# EAGLE design watchplb_gps_v1.0_AB (EAGLE 7.6.0)
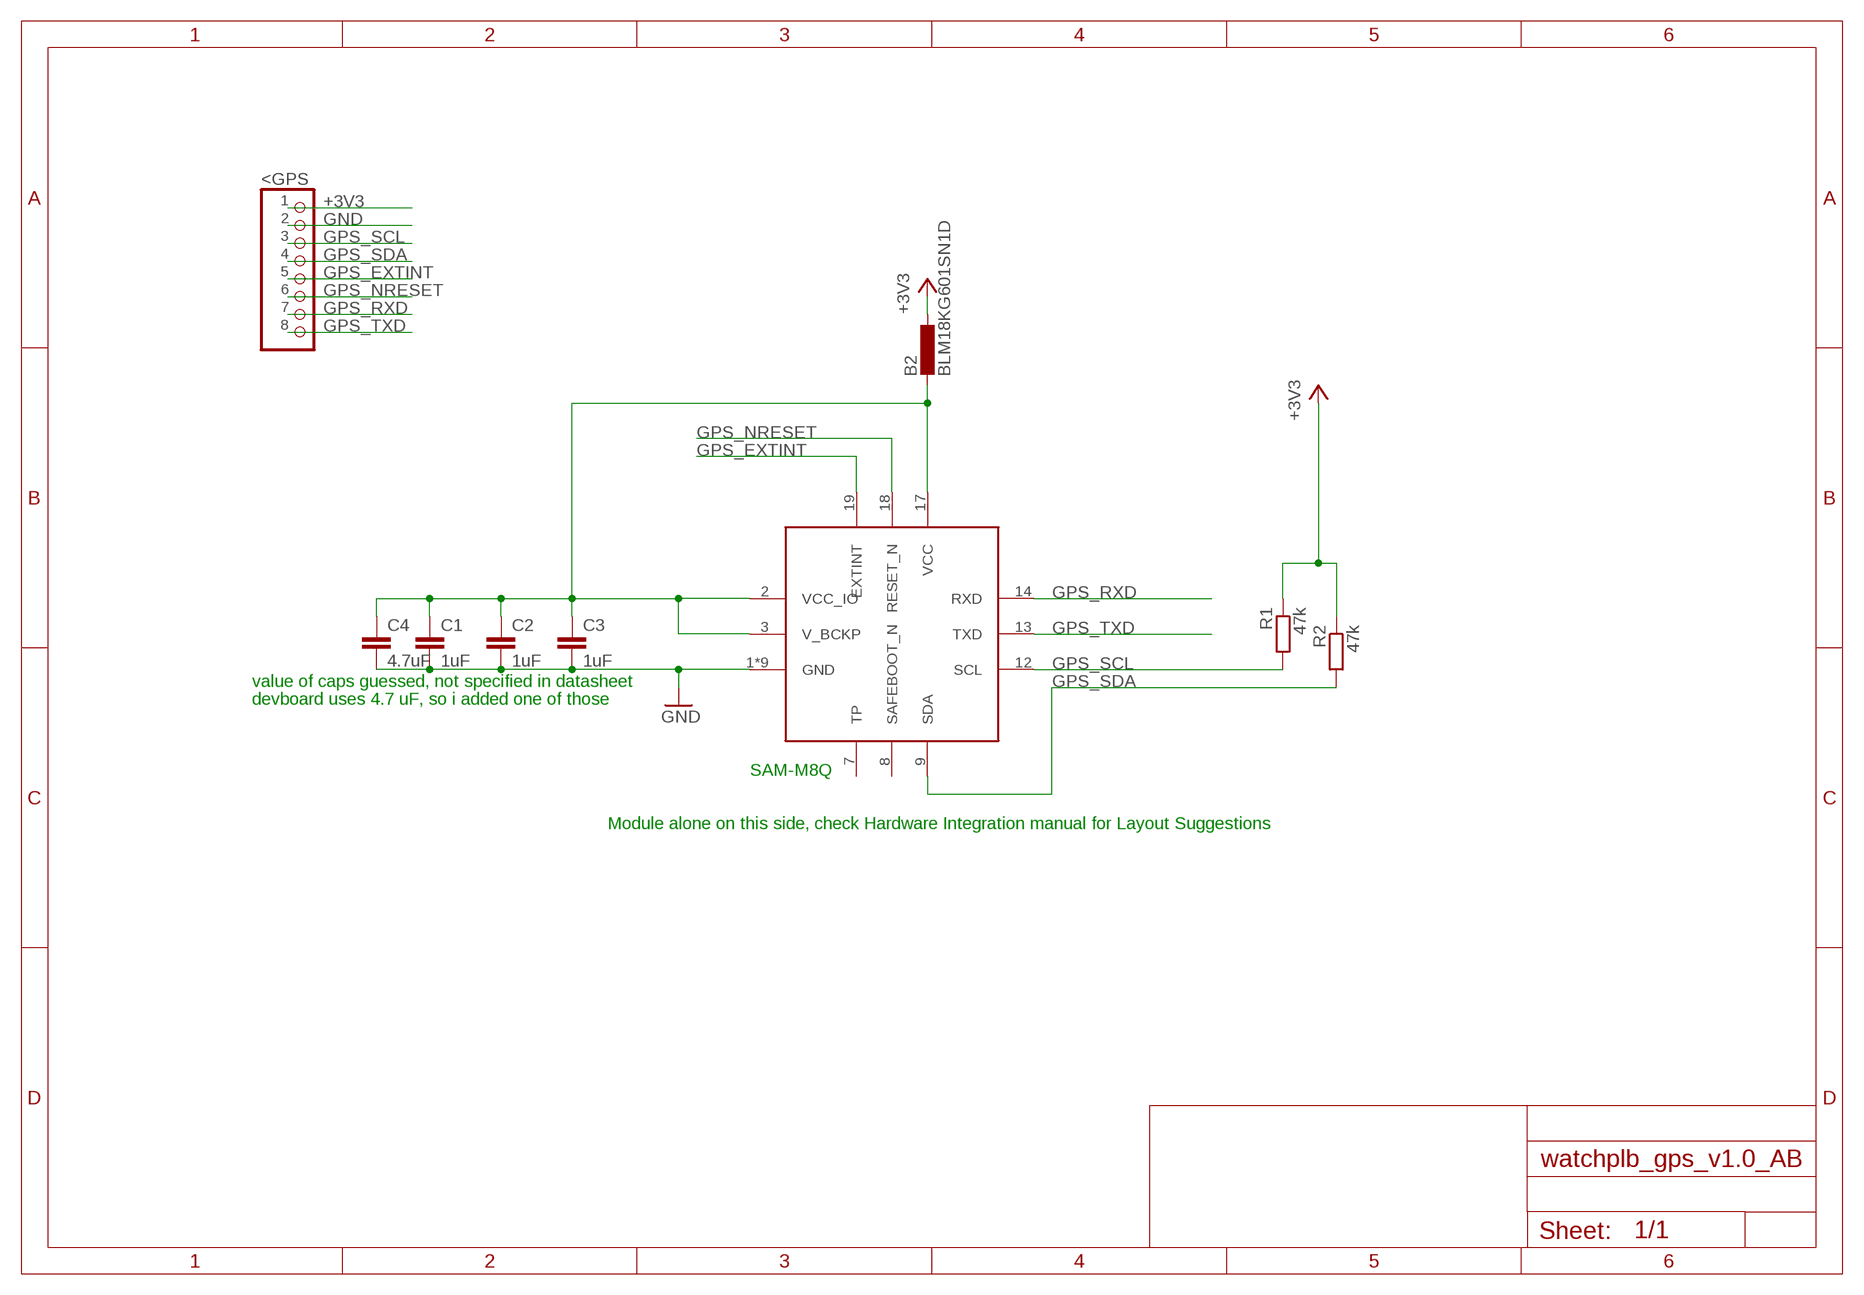
[diagram p0: schematic, sheet 1]

## Parts
<GPS  PINHD-1X8  [1X08]
B2  BLM18KG601SN1D  B-EU_B0603  [L0603]
C1  1uF  C-EUC0805  [C0805]
C2  1uF  C-EUC0805  [C0805]
C3  1uF  C-EUC0805  [C0805]
C4  4.7uF  C-EUC0805  [C0805]
IC1  SAM-M8Q  [SAM-M8Q]
R1  47k  R-EU_M0805  [M0805]
R2  47k  R-EU_M0805  [M0805]

## Nets
+3V3: <GPS.1 B2.1 R1.1 R2.1
GND: <GPS.2 C1.2 C2.2 C3.2 C4.2 IC1.1(GND) IC1.4(GND) IC1.5(GND) IC1.6(GND) IC1.10(GND) IC1.11(GND) IC1.15(GND) IC1.16(GND) IC1.20(GND)
GPS_EXTINT: <GPS.5 IC1.19(EXTINT)
GPS_NRESET: <GPS.6 IC1.18(RESET_N)
GPS_RXD: <GPS.7 IC1.14(RXD)
GPS_SCL: <GPS.3 IC1.12(SCL) R1.2
GPS_SDA: <GPS.4 IC1.9(SDA) R2.2
GPS_TXD: <GPS.8 IC1.13(TXD)
N$79: B2.2 C1.1 C2.1 C3.1 C4.1 IC1.2(VCC_IO) IC1.3(V_BCKP) IC1.17(VCC)
Unconnected: IC1.7(TP) IC1.8(SAFEBOOT_N)

## Notes on the sheet
- value of caps guessed, not specified in datasheet
- devboard uses 4.7 uF, so i added one of those
- SAM-M8Q
- Module alone on this side, check Hardware Integration manual for Layout Suggestions

## Library data of the parts
<GPS = pinhead:PINHD-1X8: PIN HEADER
B2 = PCB4_Demoboard:B-EU_: EMI Filter
C1-C4 = resistor:C-EU: CAPACITOR, European symbol
IC1 = ubloxLib:SAM-M8Q: u-blox SAM GNSS antenna module
R1 R2 = resistor:R-EU_: RESISTOR, European symbol

## Board
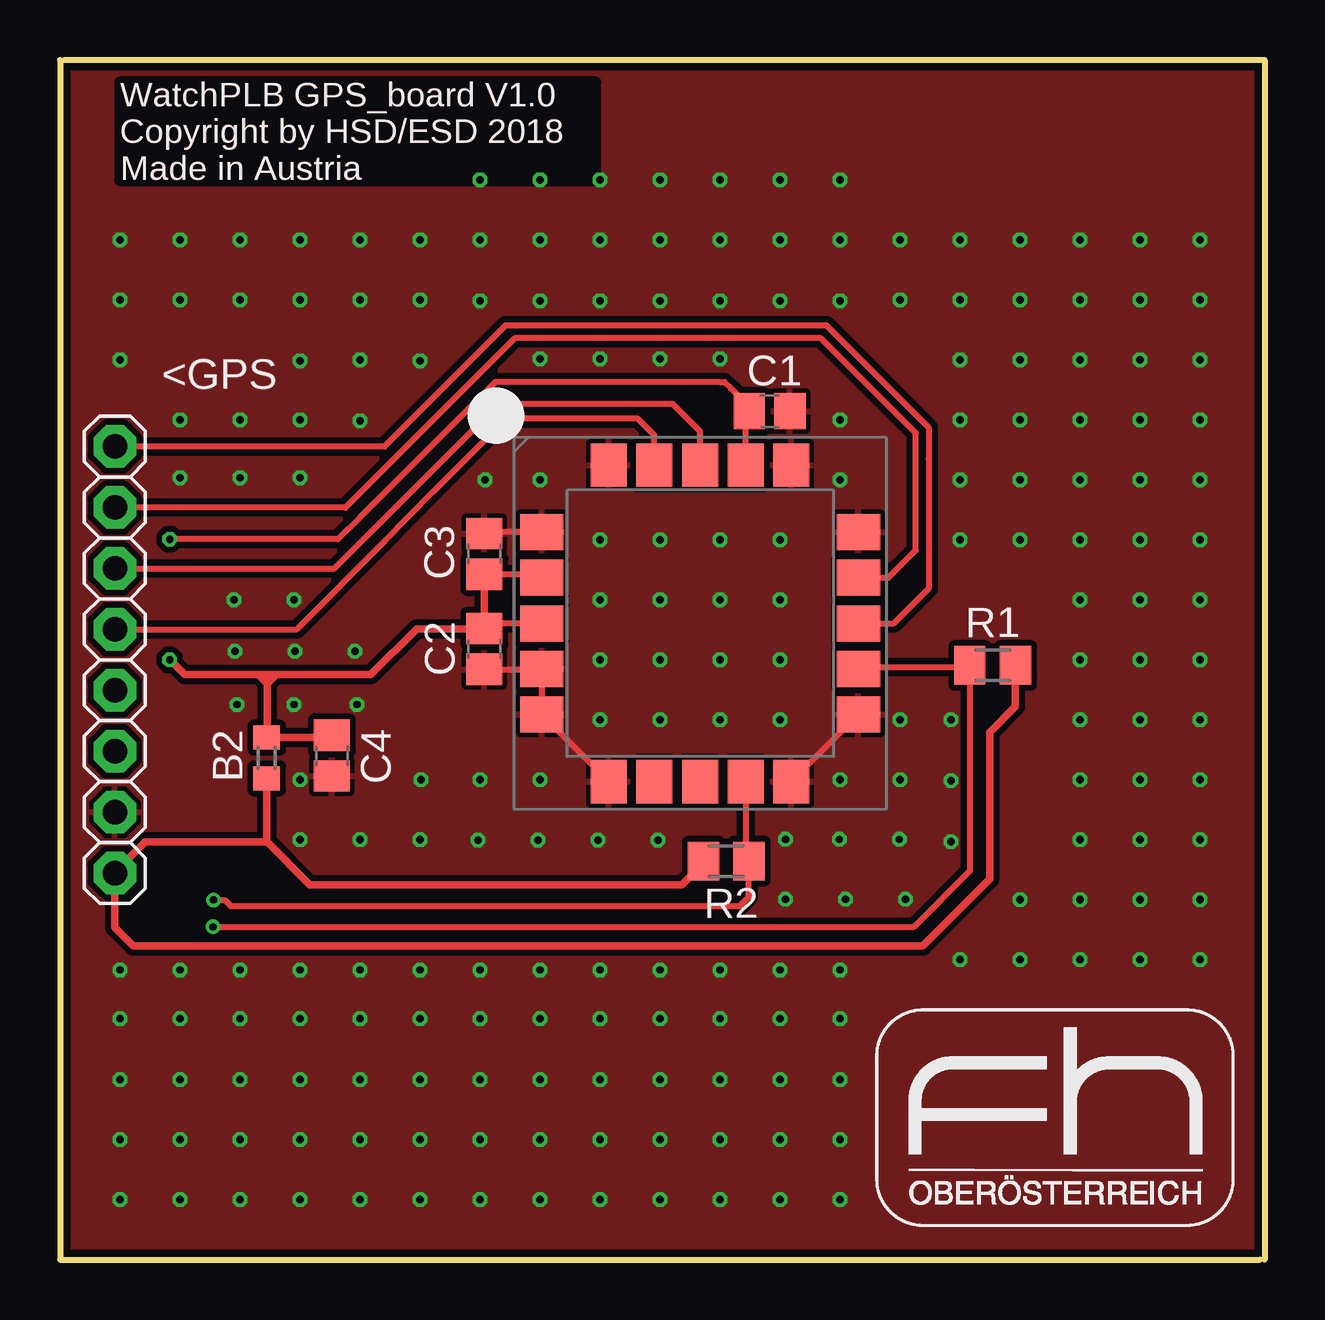
[diagram p1: board, top side]
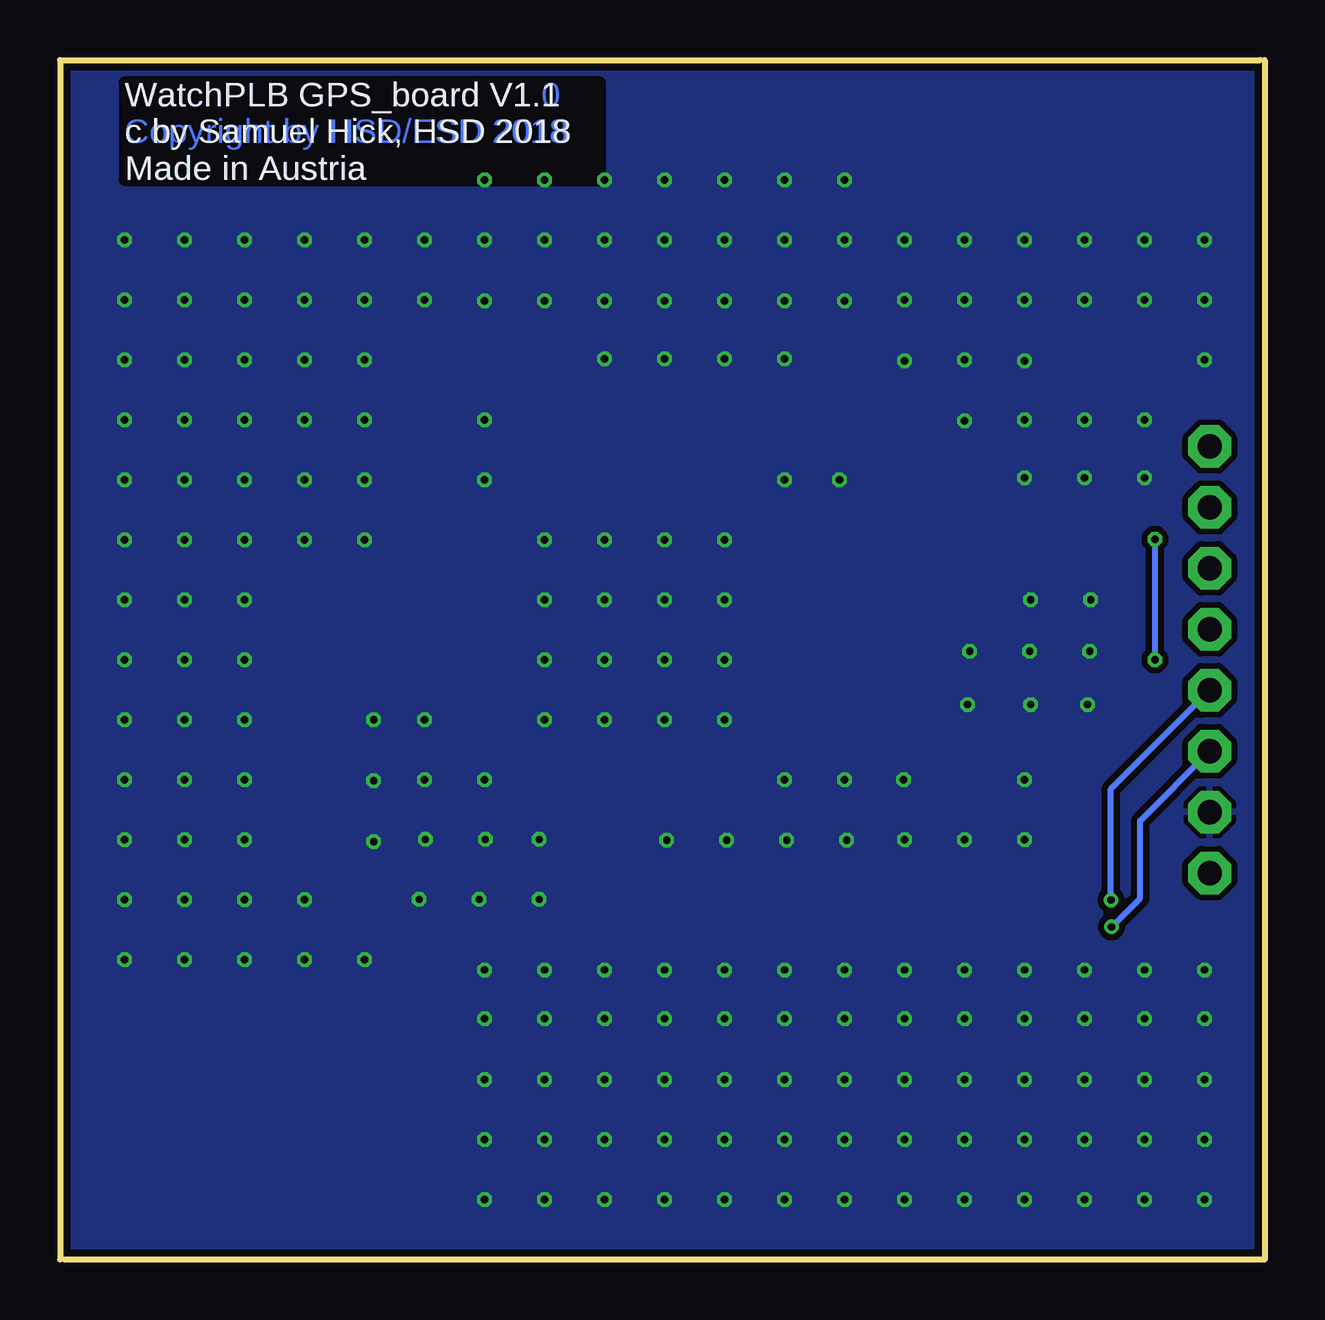
[diagram p2: board, bottom side, seen from below]

Size 50.19 x 50 mm. Coordinates in mm from the lower left corner, seen from the top.
Outline: 50.19,0 50.19,50 0.19,50
Outline: 0,50 0,0 50,0
Copper layers (1*16): Top 0.035mm / dielectric 1.5mm / Bottom 0.035mm
Design rules "PCB-POOL Standard": minimum track width 0.15mm, minimum drill 0.3mm, track to track 0.15mm, track to pad 0.15mm, pad to pad 0.15mm, via to via 0.15mm, smd to smd 0.15mm, copper to edge 0.3mm, drill to drill 0.2mm, minimum pad ring 0.2mm, minimum via ring 0.15mm, stop-mask expansion 0.075mm, vias tented up to drill 0mil, thermal gap 0.2mm

### Footprints (pad centres in the part's own frame; a part is rotated, then mirrored left to right if it is on the bottom)
1X08 = drill 1.016 pad 1.778 octagon: 1 -8.89,0; 2 -6.35,0; 3 -3.81,0; 4 -1.27,0; 5 1.27,0; 6 3.81,0; 7 6.35,0; 8 8.89,0
L0603 = smd 1 x 1.1: 1 -0.85,0; 2 0.85,0
C0805 = smd 1.3 x 1.5: 1 -0.85,0; 2 0.85,0
SAM-M8Q = smd 1.8 x 1.5: 1 -6.6,3.8; 2 -6.6,1.9; 3 -6.6,0; 4 -6.6,-1.9; 5 -6.6,-3.8; 11 6.6,-3.8; 12 6.6,-1.9; 13 6.6,0; 14 6.6,1.9; 15 6.6,3.8 | smd 1.5 x 1.8: 6 -3.8,-6.6; 7 -1.9,-6.6; 8 0,-6.6; 9 1.9,-6.6; 10 3.8,-6.6; 16 3.8,6.6; 17 1.9,6.6; 18 0,6.6; 19 -1.9,6.6; 20 -3.8,6.6
M0805 = smd 1.3 x 1.6: 1 -0.95,0; 2 0.95,0

### Placement (x,y rotation side)
<GPS  2.29,25 90 top
B2  8.61,20.9 90 top
C1  29.57,35.36 0 top
C2  17.68,25.45 270 top
C3  17.68,29.41 90 top
C4  11.33,21.01 270 top
IC1  26.67,26.52 0 top
R1  38.86,24.77 180 top
R2  27.76,16.61 0 top
U$1  [FH_LOGO_050]  33.79,1.21 0 top

### Tracks (layer width: path | path; a pad name or v marks a point on that pad's centre or on a via)
+3V3
  Top 0.305: 8.64,20.03 B2.1 8.61,19.15 8.61,17.4 | R1.1 39.81,23.05 38.73,21.97 38.73,15.88 35.94,13.08 3.05,13.08 2.29,13.84 <GPS.1 2.29,16.13 3.56,17.4 6.86,17.4 8.61,17.4 | R2.1 26.42,16.21 26.42,16.13 26.16,15.88 25.91,15.62 10.92,15.62 10.41,15.62 8.64,17.4 8.61,17.4
GND  (via drill 0.3)
  Top 0.254: C2.2 19.9,24.6 IC1.4 IC1.5 IC1.6 | IC1.10 IC1.11 | IC1.1 17.58,30.32 C3.2
  other vias: 5,5 2.5,5 2.5,2.5 5,2.5 2.5,7.5 5,7.5 7.5,7.5 7.5,5 7.5,2.5 10,2.5 10,5 10,7.5 12.5,7.5 12.5,5 12.5,2.5 27.5,5 25,5 25,2.5 27.5,2.5 25,7.5 27.5,7.5 30,7.5 30,5 30,2.5 32.5,2.5 32.5,5 32.5,7.5 37.5,12.5 40,12.5 42.5,12.5 45,12.5 47.5,12.5 40,15 15,5 15,2.5 15,7.5 17.5,7.5 17.5,5 17.5,2.5 20,2.5 20,5 20,7.5 22.5,7.5 22.5,5 22.5,2.5 42.5,15 42.5,17.5 42.5,20 45,20 45,17.5 45,15 47.5,15 47.5,17.5 47.5,20 42.5,25 42.5,22.5 45,22.5 45,25 47.5,25 47.5,22.5 42.5,27.5 42.5,30 42.5,32.5 45,32.5 45,30 45,27.5 47.5,27.5 47.5,30 47.5,32.5 40,30 37.5,30 37.5,32.5 40,32.5 40,35 37.5,35 37.5,37.5 40,37.5 42.5,37.5 42.5,35 45,35 45,37.5 47.5,37.5 47.5,35 42.5,42.5 42.5,40 45,40 45,42.5 47.5,42.5 47.5,40 40,40 37.5,40 37.5,42.5 40,42.5 35,42.5 35,40 32.5,42.5 32.5,45 30,45 30,42.5 27.5,42.5 27.5,45 25,45 25,42.5 22.5,42.5 22.5,45 20,45 20,42.5 17.5,42.5 17.5,45 15,42.5 15,40 12.5,40 12.5,37.5 10,35 7.5,35 5,35 2.5,37.5 5,40 2.5,40 2.5,42.5 5,42.5 7.5,42.5 10,42.5 12.5,42.5 10,40 7.5,40 7.37,23.14 9.75,23.14 12.37,23.14 15.04,20 12.5,17.5 10,17.5 10,20 15,17.5 17.5,20 20,20 32.5,20 35,20 35,22.5 37.12,22.5 32.5,32.5 32.5,35 30,30 27.5,30 25,30 22.5,30 22.5,27.5 25,27.5 27.5,27.5 30,27.5 30,25 27.5,25 25,25 22.5,25 22.5,22.5 25,22.5 27.5,22.5 30,22.5 20,32.5 7.25,27.5 9.75,27.5 2.5,10.04 5,10.04 7.5,10.04 10,10.04 12.5,10.04 25,10.04 27.5,10.04 30,10.04 32.5,10.04 15,10.04 17.5,10.04 20,10.04 22.5,10.04 2.5,12.07 5,12.07 7.5,12.07 10,12.07 12.5,12.07 25,12.07 27.5,12.07 30,12.07 32.5,12.07 15,12.07 17.5,12.07 20,12.07 22.5,12.07 34.97,17.51 35.22,15.01 32.72,15.01 32.47,17.51 30.22,17.51 30.22,15.01 24.91,17.48 22.41,17.48 19.91,17.48 17.41,17.48 32.5,39.96 30,39.96 27.5,39.96 25,39.96 22.5,39.96 20,39.96 17.5,39.96 17.71,32.5 15,37.46 10,37.46 12.5,34.96 10,32.59 7.5,32.59 5,32.59 12.29,25.35 9.79,25.35 7.29,25.35 27.5,37.55 25,37.55 22.5,37.55 20,37.55 37.12,19.96 37.12,17.42
  pour Top (isolate 0.254): 0,50 0,0 50,0 50,50
  pour Bottom (isolate 0.254): 0,50 0,0 50,0 50,50
GPS_EXTINT
  Top 0.254: IC1.19 24.77,34.36 24.08,35.05 18.59,35.05 15.54,32 13.51,29.92 9.86,26.26 <GPS.5
GPS_NRESET
  Top 0.254: IC1.18 26.67,34.52 25.53,35.66 18.29,35.66 14.63,32 11.44,28.81 <GPS.6
GPS_RXD
  Top 0.254: IC1.14 34.51,28.42 35.66,29.57 35.66,34.44 31.7,38.41 18.95,38.41 11.89,31.34 <GPS.7
GPS_SCL  (via drill 0.3)
  Top 0.254: IC1.12 33.16,24.57 33.28,24.69 37.84,24.69 R1.2 37.91,23.43 37.91,18.09 37.91,16.2 35.59,13.87 v6.38,13.87
  Bottom 0.254: v6.38,13.87 5.18,15.06 5.18,18.29 <GPS.3
GPS_SDA  (via drill 0.3)
  Top 0.254: v6.4,14.99 6.86,14.99 7.11,14.73 7.37,14.73 28.32,14.73 28.7,15.11 R2.2 28.57,16.75 IC1.9
  Bottom 0.254: v6.4,14.99 6.4,19.61 <GPS.4
GPS_TXD
  Top 0.254: IC1.13 34.75,26.52 36.2,27.96 36.2,33.38 36.2,34.67 31.93,38.94 31.9,38.94 18.57,38.94 13.51,33.88 <GPS.8
N$79  (via drill 0.3)
  Top 0.254: IC1.3 17.74,26.52 C2.1 | C3.1 19.77,28.56 IC1.2 | 28.35,33.05 IC1.17 28.57,35.21 C1.1 28.72,35.55 27.94,36.32 27.69,36.58 27.48,36.58 18.14,36.58 12.5,30.94 11.58,30.02 v4.57,30.02
  Top 0.305: B2.2 11.23,21.75 C4.1 | B2.2 8.61,21.82 8.64,21.84 | C2.1 C3.1 17.68,26.31 17.65,26.29 14.86,26.29 12.95,24.38 9.02,24.38 | v4.57,24.99 4.6,24.99 5.21,24.38 8.26,24.38 | 8.26,24.38 8.64,24.38 | 8.64,24.38 8.64,24 | 8.64,24 8.64,21.78 B2.2 | 9.02,24.38 8.64,24.38 | 8.64,24 8.26,24.38 | 8.64,24 9.02,24.38
  Bottom 0.254: v4.57,30.02 v4.57,24.99

### Text on the board
Top: WatchPLB GPS_board V1.0 / Copyright by HSD/ESD 2018 / Made in Austria
Bottom: WatchPLB GPS_board V1.0 / Copyright by HSD/ESD 2018 / Made in Austria
tPlace: WatchPLB GPS_board V1.0 / Copyright by HSD/ESD 2018 / Made in Austria
bPlace: WatchPLB GPS_board V1.1 / c by Samuel Hick, HSD 2018 / Made in Austria